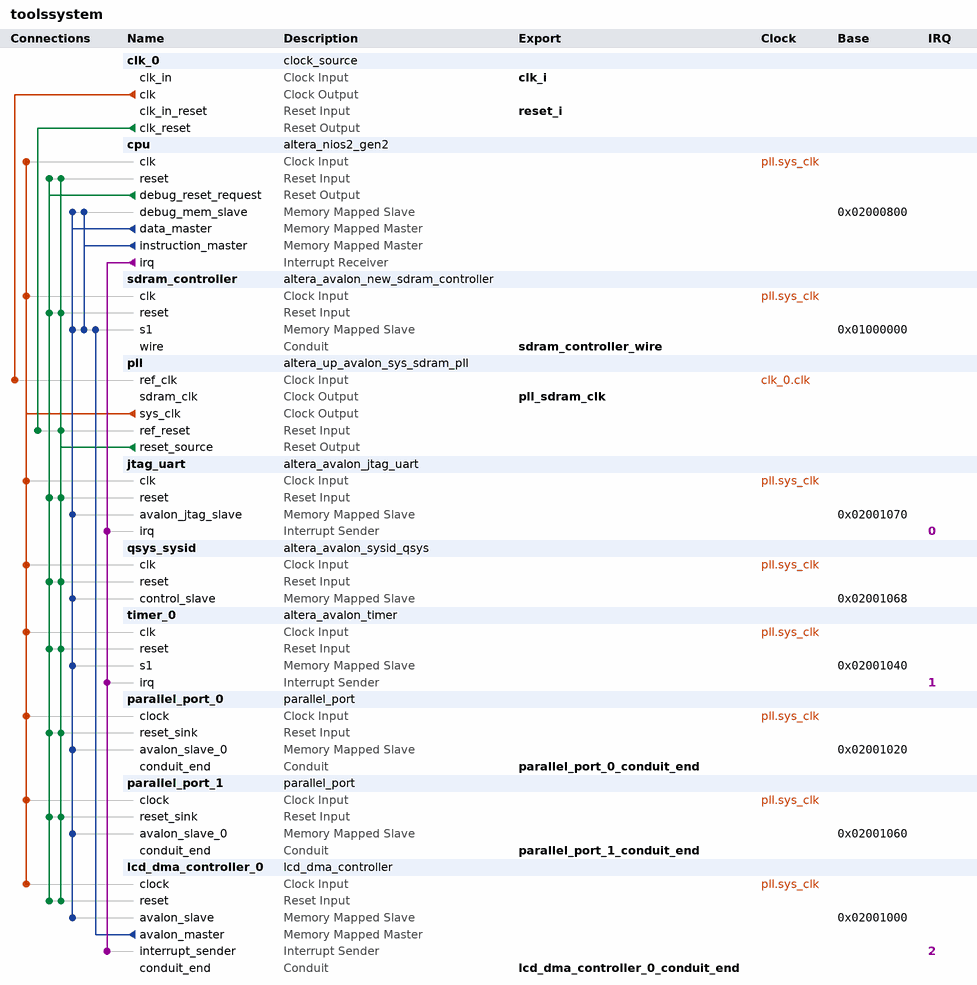
[diagram p0: system contents]
# Platform Designer (Qsys) system toolssystem, Cyclone IV E EP4CE30F23C7
# Parameters at their usual value, and those the tool derives, are not listed.
package require -exact qsys 18.1
create_system toolssystem
set_project_property DEVICE_FAMILY {Cyclone IV E}
set_project_property DEVICE EP4CE30F23C7

add_instance clk_0 clock_source 18.1
set_instance_parameter_value clk_0 clockFrequency 50000000

add_instance cpu altera_nios2_gen2 18.1
set_instance_parameter_value cpu dcache_size 2048
set_instance_parameter_value cpu exceptionSlave sdram_controller.s1
set_instance_parameter_value cpu icache_size 4096
set_instance_parameter_value cpu impl Fast
set_instance_parameter_value cpu resetSlave sdram_controller.s1

add_instance sdram_controller altera_avalon_new_sdram_controller 18.1
set_instance_parameter_value sdram_controller TAC 5.5
set_instance_parameter_value sdram_controller TRCD 20.0
set_instance_parameter_value sdram_controller TRP 20.0
set_instance_parameter_value sdram_controller casLatency 3
set_instance_parameter_value sdram_controller columnWidth 9
set_instance_parameter_value sdram_controller dataWidth 16
set_instance_parameter_value sdram_controller generateSimulationModel false
set_instance_parameter_value sdram_controller model single_Micron_MT48LC4M32B2_7_chip
set_instance_parameter_value sdram_controller numberOfBanks 4
set_instance_parameter_value sdram_controller numberOfChipSelects 1
set_instance_parameter_value sdram_controller powerUpDelay 100.0
set_instance_parameter_value sdram_controller refreshPeriod 15.625
set_instance_parameter_value sdram_controller rowWidth 12

add_instance pll altera_up_avalon_sys_sdram_pll 18.0
set_instance_parameter_value pll CIV_boards DE0-Nano
set_instance_parameter_value pll CV_boards DE10-Standard
set_instance_parameter_value pll gui_outclk 50.0
set_instance_parameter_value pll gui_refclk 50.0

add_instance jtag_uart altera_avalon_jtag_uart 18.1
set_instance_parameter_value jtag_uart simInteractiveOptions NO_INTERACTIVE_WINDOWS

add_instance qsys_sysid altera_avalon_sysid_qsys 18.1
set_instance_parameter_value qsys_sysid id -1515870811

add_instance timer_0 altera_avalon_timer 18.1
set_instance_parameter_value timer_0 fixedPeriod true
set_instance_parameter_value timer_0 period 10
set_instance_parameter_value timer_0 periodUnits MSEC

add_instance parallel_port_0 parallel_port 1.0
set_instance_parameter_value parallel_port_0 N 32

add_instance parallel_port_1 parallel_port 1.0
set_instance_parameter_value parallel_port_1 N 8

add_instance lcd_dma_controller_0 lcd_dma_controller 1.0
set_instance_parameter_value lcd_dma_controller_0 N 16

# connections
add_connection clk_0.clk pll.ref_clk clock
add_connection pll.sys_clk cpu.clk clock
add_connection pll.sys_clk jtag_uart.clk clock
add_connection pll.sys_clk lcd_dma_controller_0.clock clock
add_connection pll.sys_clk parallel_port_0.clock clock
add_connection pll.sys_clk parallel_port_1.clock clock
add_connection pll.sys_clk qsys_sysid.clk clock
add_connection pll.sys_clk sdram_controller.clk clock
add_connection pll.sys_clk timer_0.clk clock
add_connection clk_0.clk_reset pll.ref_reset reset
add_connection cpu.debug_reset_request cpu.reset reset
add_connection cpu.debug_reset_request jtag_uart.reset reset
add_connection cpu.debug_reset_request lcd_dma_controller_0.reset reset
add_connection cpu.debug_reset_request parallel_port_0.reset_sink reset
add_connection cpu.debug_reset_request parallel_port_1.reset_sink reset
add_connection cpu.debug_reset_request qsys_sysid.reset reset
add_connection cpu.debug_reset_request sdram_controller.reset reset
add_connection cpu.debug_reset_request timer_0.reset reset
add_connection pll.reset_source cpu.reset reset
add_connection pll.reset_source jtag_uart.reset reset
add_connection pll.reset_source lcd_dma_controller_0.reset reset
add_connection pll.reset_source parallel_port_0.reset_sink reset
add_connection pll.reset_source parallel_port_1.reset_sink reset
add_connection pll.reset_source pll.ref_reset reset
add_connection pll.reset_source qsys_sysid.reset reset
add_connection pll.reset_source sdram_controller.reset reset
add_connection pll.reset_source timer_0.reset reset
add_connection cpu.data_master cpu.debug_mem_slave avalon
set_connection_parameter_value cpu.data_master/cpu.debug_mem_slave baseAddress 0x02000800
add_connection cpu.data_master jtag_uart.avalon_jtag_slave avalon
set_connection_parameter_value cpu.data_master/jtag_uart.avalon_jtag_slave baseAddress 0x02001070
add_connection cpu.data_master lcd_dma_controller_0.avalon_slave avalon
set_connection_parameter_value cpu.data_master/lcd_dma_controller_0.avalon_slave baseAddress 0x02001000
add_connection cpu.data_master parallel_port_0.avalon_slave_0 avalon
set_connection_parameter_value cpu.data_master/parallel_port_0.avalon_slave_0 baseAddress 0x02001020
add_connection cpu.data_master parallel_port_1.avalon_slave_0 avalon
set_connection_parameter_value cpu.data_master/parallel_port_1.avalon_slave_0 baseAddress 0x02001060
add_connection cpu.data_master qsys_sysid.control_slave avalon
set_connection_parameter_value cpu.data_master/qsys_sysid.control_slave baseAddress 0x02001068
add_connection cpu.data_master sdram_controller.s1 avalon
set_connection_parameter_value cpu.data_master/sdram_controller.s1 baseAddress 0x01000000
add_connection cpu.data_master timer_0.s1 avalon
set_connection_parameter_value cpu.data_master/timer_0.s1 baseAddress 0x02001040
add_connection cpu.instruction_master cpu.debug_mem_slave avalon
set_connection_parameter_value cpu.instruction_master/cpu.debug_mem_slave baseAddress 0x02000800
add_connection cpu.instruction_master sdram_controller.s1 avalon
set_connection_parameter_value cpu.instruction_master/sdram_controller.s1 baseAddress 0x01000000
add_connection lcd_dma_controller_0.avalon_master sdram_controller.s1 avalon
set_connection_parameter_value lcd_dma_controller_0.avalon_master/sdram_controller.s1 baseAddress 0x01000000
add_connection cpu.irq jtag_uart.irq interrupt
set_connection_parameter_value cpu.irq/jtag_uart.irq irqNumber 0
add_connection cpu.irq lcd_dma_controller_0.interrupt_sender interrupt
set_connection_parameter_value cpu.irq/lcd_dma_controller_0.interrupt_sender irqNumber 2
add_connection cpu.irq timer_0.irq interrupt
set_connection_parameter_value cpu.irq/timer_0.irq irqNumber 1

# exported interfaces
add_interface clk_i clock sink
set_interface_property clk_i EXPORT_OF clk_0.clk_in
add_interface lcd_dma_controller_0_conduit_end conduit end
set_interface_property lcd_dma_controller_0_conduit_end EXPORT_OF lcd_dma_controller_0.conduit_end
add_interface parallel_port_0_conduit_end conduit end
set_interface_property parallel_port_0_conduit_end EXPORT_OF parallel_port_0.conduit_end
add_interface parallel_port_1_conduit_end conduit end
set_interface_property parallel_port_1_conduit_end EXPORT_OF parallel_port_1.conduit_end
add_interface pll_sdram_clk clock source
set_interface_property pll_sdram_clk EXPORT_OF pll.sdram_clk
add_interface reset_i reset sink
set_interface_property reset_i EXPORT_OF clk_0.clk_in_reset
add_interface sdram_controller_wire conduit end
set_interface_property sdram_controller_wire EXPORT_OF sdram_controller.wire

set_interconnect_requirement {$system} qsys_mm.clockCrossingAdapter HANDSHAKE
set_interconnect_requirement {$system} qsys_mm.enableEccProtection FALSE
set_interconnect_requirement {$system} qsys_mm.insertDefaultSlave FALSE
set_interconnect_requirement {$system} qsys_mm.maxAdditionalLatency 1

save_system toolssystem.qsys
